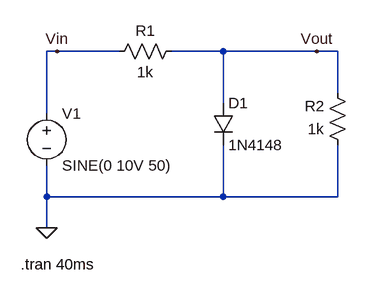
[diagram p0: schematic Assignment-3.3 Diode Application.asc]
Assignment-3.3 Diode Application.asc, the LTspice schematic file:
Version 4.1
SHEET 1 880 680
WIRE 48 64 32 64
WIRE 144 64 48 64
WIRE 304 64 224 64
WIRE 448 64 304 64
WIRE 480 64 448 64
WIRE 480 128 480 64
WIRE 304 144 304 64
WIRE 32 160 32 64
WIRE 32 288 32 240
WIRE 304 288 304 208
WIRE 304 288 32 288
WIRE 480 288 480 208
WIRE 480 288 304 288
WIRE 32 336 32 288
FLAG 32 336 0
FLAG 48 64 Vin
FLAG 448 64 Vout
SYMBOL voltage 32 144 R0
SYMATTR InstName V1
SYMATTR Value SINE(0 10V 50)
SYMBOL res 240 48 R90
WINDOW 0 0 56 VBottom 2
WINDOW 3 32 56 VTop 2
SYMATTR InstName R1
SYMATTR Value 1k
SYMBOL res 496 224 R180
WINDOW 0 36 76 Left 2
WINDOW 3 36 40 Left 2
SYMATTR InstName R2
SYMATTR Value 1k
SYMBOL diode 288 144 R0
SYMATTR InstName D1
SYMATTR Value 1N4148
TEXT -8 392 Left 2 !.tran 40ms

The netlist it stands for:
* Assignment-3.3 Diode Application.asc
V1 Vin 0 SINE(0 10V 50)
R1 Vout Vin 1k
R2 0 Vout 1k
D1 Vout 0 1N4148
.model D D
.lib standard.dio
.tran 40ms
.backanno
.end